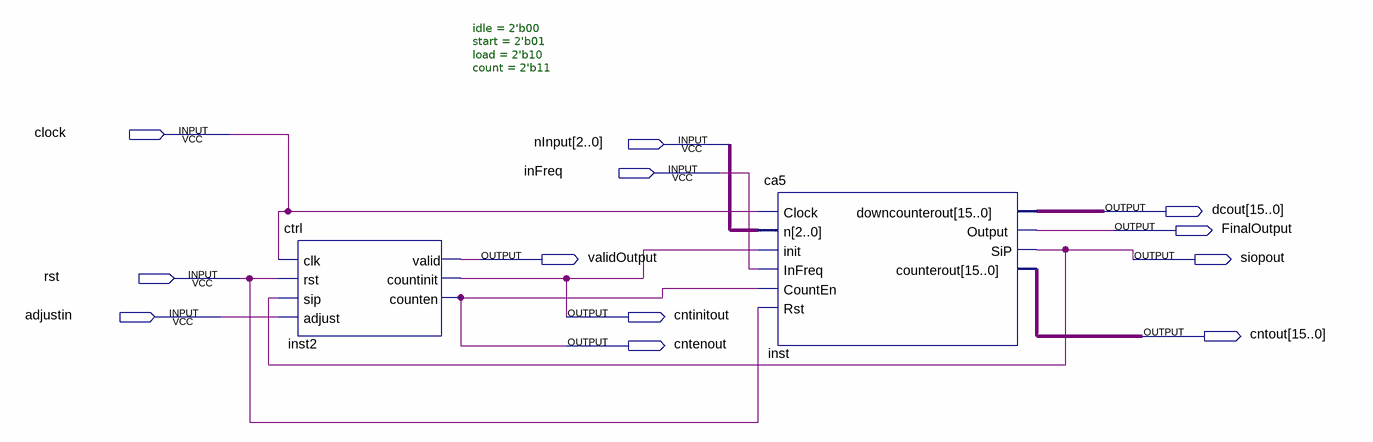
[diagram p0: schematic sheet]
// Quartus schematic Multiplier.bdf as structural Verilog: 2 symbols, 12 pins
module Multiplier (
  input  clock,
  input  [2:0] nInput,
  input  inFreq,
  input  rst,
  input  adjustin,
  output [15:0] dcout,
  output FinalOutput,
  output validOutput,
  output siopout,
  output cntinitout,
  output [15:0] cntout,
  output cntenout
);

  ctrl #(.idle(2'b00), .start(2'b01), .load(2'b10), .count(2'b11)) inst2 (
    .clk(clock), .rst(rst), .sip(siopout), .adjust(adjustin), .valid(validOutput), .counten(cntenout),
    .countinit(cntinitout));
  ca5 inst (
    .Clock(clock), .n(nInput), .init(cntinitout), .InFreq(inFreq), .CountEn(cntenout), .Rst(rst),
    .downcounterout(dcout), .Output(FinalOutput), .SiP(siopout), .counterout(cntout));
endmodule
